# EAGLE design Bitirme deneme (EAGLE 9.6.2)
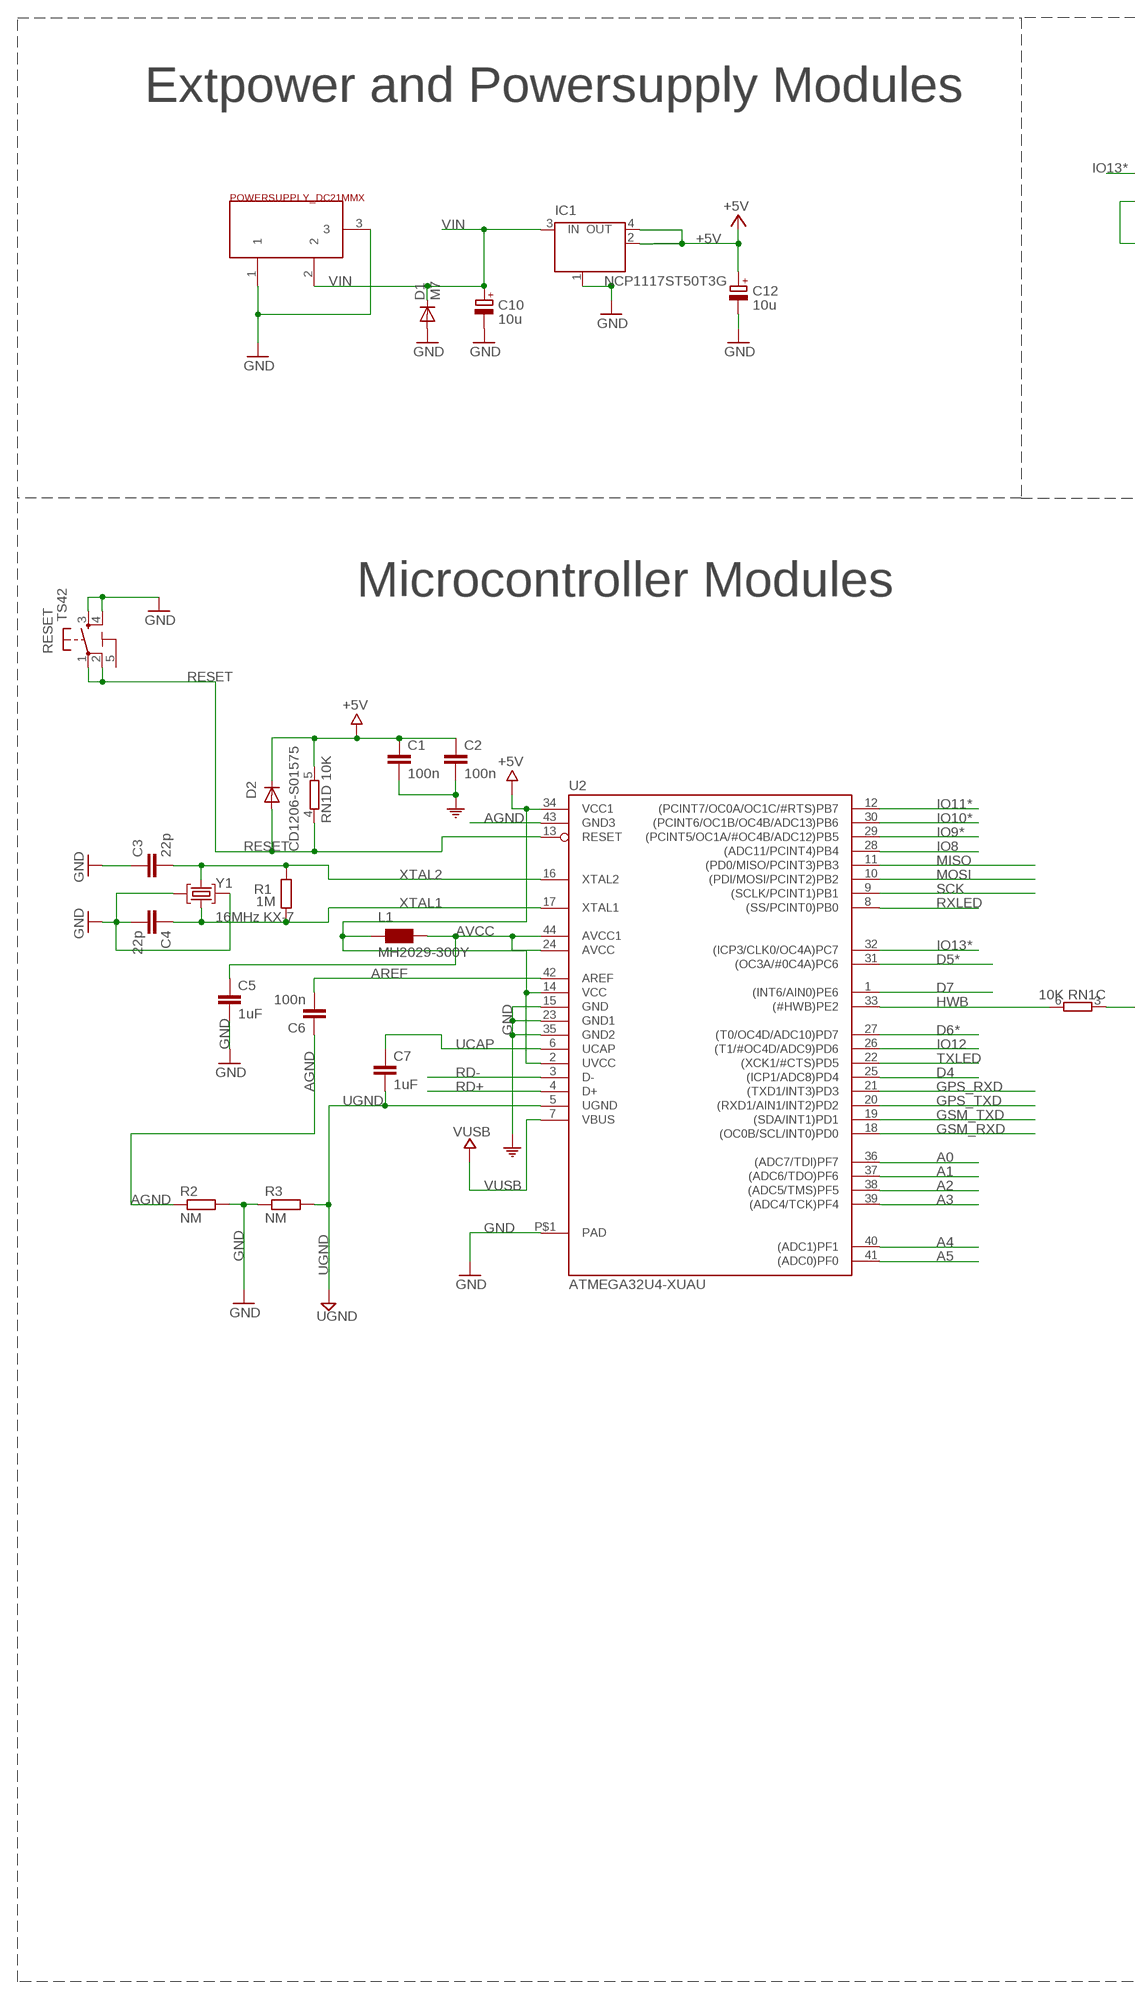
[diagram p0: schematic, sheet 1, part 1 of 2]
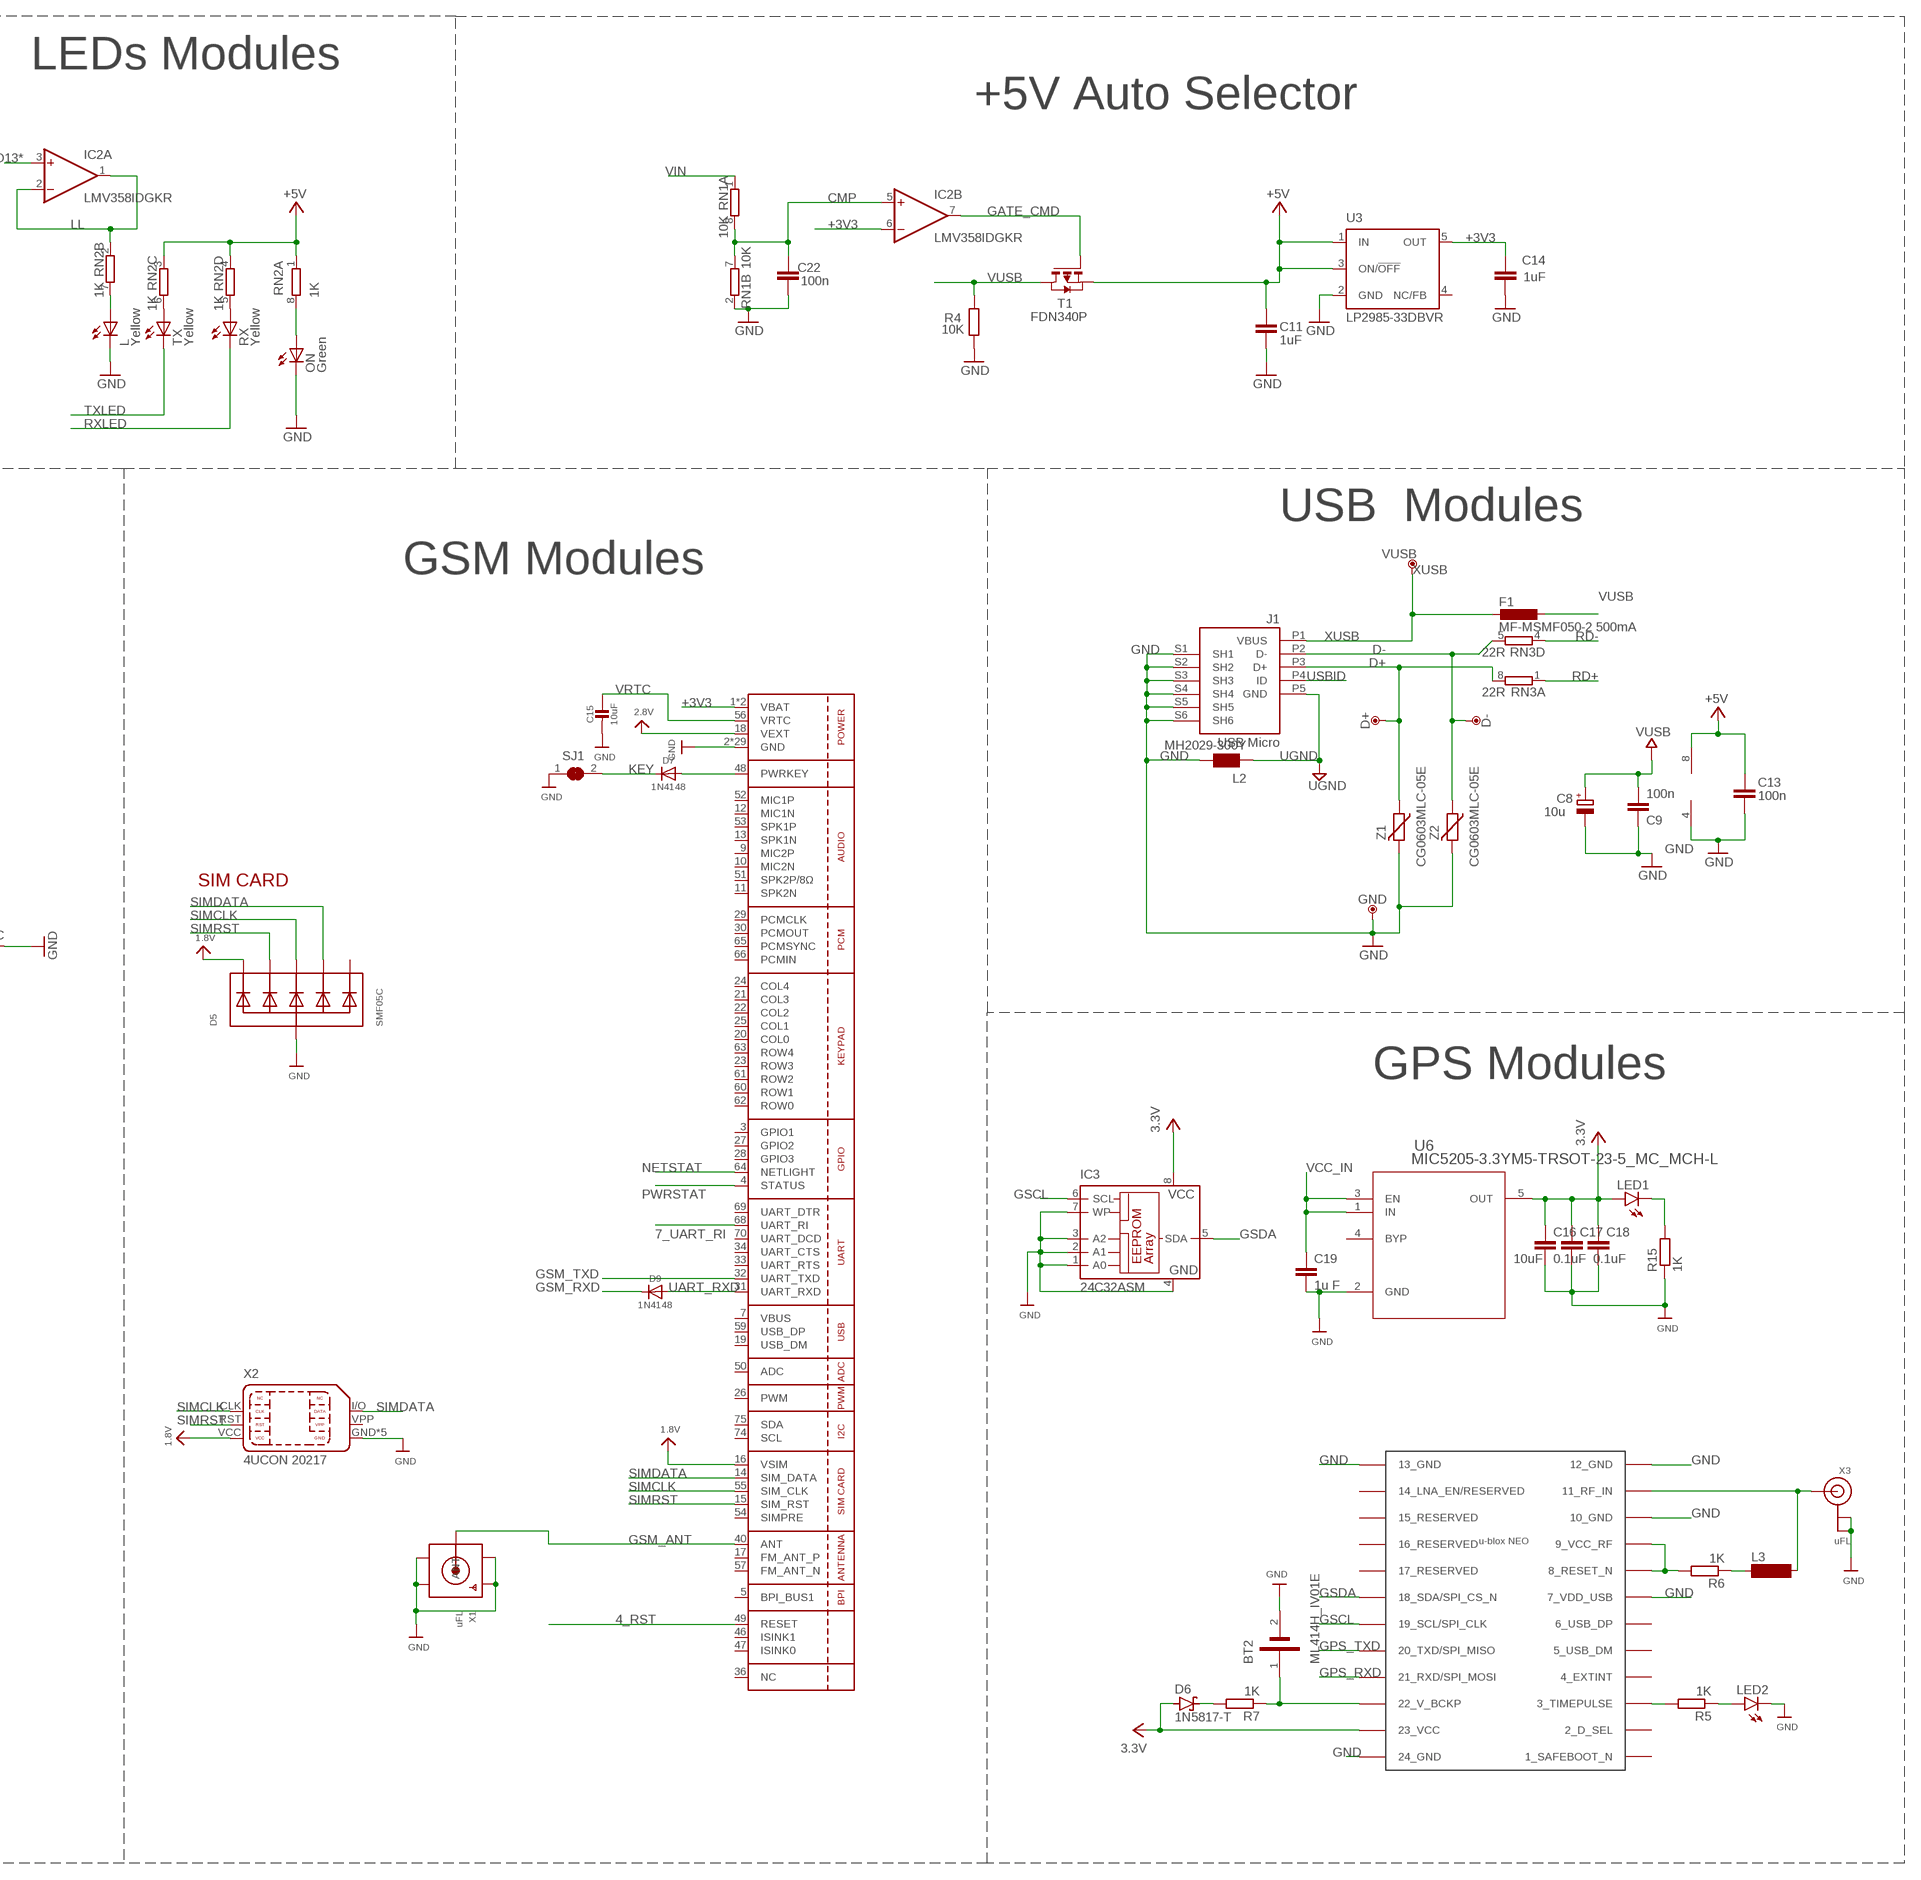
[diagram p1: schematic, sheet 1, part 2 of 2]

## Parts
BT2  ML414H_IV01E  [SEIKO_ML414H_IV01E]
C1  100n  C-EUC0603  [C0603-ROUND]
C2  100n  C-EUC0603  [C0603-ROUND]
C3  22p  C-EUC0603  [C0603-ROUND]
C4  22p  C-EUC0603  [C0603-ROUND]
C5  1uF  C-EUC0603  [C0603-ROUND]
C6  100n  C-EUC0603  [C0603-ROUND]
C7  1uF  C-EUC0603  [C0603-ROUND]
C8  10u  CPOL-EUSMCB  [SMC_B]
C9  100n  C-EUC0603  [C0603-ROUND]
C10  10u  CPOL-EUSMCB  [SMC_B]
C11  1uF  C-EUC0603  [C0603-ROUND]
C12  10u  CPOL-EUSMCB  [SMC_B]
C13  100n  C-EUC0603  [C0603-ROUND]
C14  1uF  C-EUC0603  [C0603-ROUND]
C15  10uF  CAP_CERAMIC_0805MP  [_0805MP]
C16  10uF  C-EUC0603K  [C0603K]
C17  0.1uF  C-EUC0603K  [C0603K]
C18  0.1uF  C-EUC0603K  [C0603K]
C19  1u F  C-EUC0603K  [C0603K]
C22  100n  C-EUC0603  [C0603-ROUND]
D1  M7  DIODE-SMB  [SMB]
D2  CD1206-S01575  DIODE-MINIMELF  [MINIMELF]
D5  SMF05C  TVSARRAY_5LANE  [SOT363]
D6  1N5817-T  [DO41-7.6]
D7  1N4148  DIODESOD-323  [SOD-323]
D9  1N4148  DIODESOD-323  [SOD-323]
D+  DNP  TPTP-1.00MM  [TP-1.00MM]
D-  DNP  TPTP-1.00MM  [TP-1.00MM]
EXTPOWER  POWERSUPPLY_DC21MMX  [POWERSUPPLY_DC-21MM]
F1  MF-MSMF050-2 500mA  L-EUL1812  [L1812]
GND  DNP  TPTP-1.00MM  [TP-1.00MM]
IC1  NCP1117ST50T3G  MC33269ST-3.3T3  [SOT223]
IC2  LMV358IDGKR  LMV358MMX  [MSOP08]
IC3  24C32ASM  [SO-08M]
J1  USB Micro  USB-MICRO-LEGACY  [CON2_USB_MICRO_B_AT]
L  Yellow  LEDCHIPLED_0805  [CHIPLED_0805]
L1  MH2029-300Y  WE-CBF_0805  [0805]
L2  MH2029-300Y  WE-CBF_0805  [0805]
L3  SM-1206  [SM-1206]
LED1  LEDCHIP-LED0603  [CHIP-LED0603]
LED2  LEDCHIPLED_1206  [CHIPLED_1206]
ON  Green  LEDCHIPLED_0805  [CHIPLED_0805]
R1  1M  R-EU_R0603  [R0603-ROUND]
R2  NM  R-EU_R0402  [R0402]
R3  NM  R-EU_R0402  [R0402]
R4  10K  R-EU_R0603  [R0603-ROUND]
R5  1K  R-EU_R0402  [R0402]
R6  1K  R-EU_R0402  [R0402]
R7  1K  R-EU_R0402  [R0402]
R15  1K  R-EU_R0402  [R0402]
RESET  TS42  [TS42]
RN1  10K  4R-NCAY16  [CAY16]
RN2  1K  4R-NCAY16  [CAY16]
RN3  22R  4R-NCAY16  [CAY16]
RX  Yellow  LEDCHIPLED_0805  [CHIPLED_0805]
SJ1  SOLDERJUMPER_CLOSED  [SOLDERJUMPER_CLOSEDWIRE]
T1  FDN340P  PMOSSOT23  [SOT-23]
TX  Yellow  LEDCHIPLED_0805  [CHIPLED_0805]
U2  ATMEGA32U4-XUAU  [TQFP44-PAD]
U3  LP2985-33DBVR  LP2985-XXDBVR33  [SOT23-DBV]
U4  SIM800H/L  GSM_SIM800L  [SIM800L]
U6  MIC5205-3.3YM5-TRSOT-23-5_MC_MCH-L  [SOT-23-5_MC_MCH-L]
U$10  NEO-M8  [NEO-M8]
VUSB  DNP  TPTP-1.00MM  [TP-1.00MM]
X1  uFL  SMACONNECTOR_EDGE_UFL  [SMA_EDGELAUNCH_UFL]
X2  4UCON 20217  SIM_MICRO  [4UCONN_20217]
X3  uFL  ANTENNA_U.FL  [U.FL]
Y1  16MHz KX-7  CRYSTAL-3.2-2.5  [CRYSTAL-3.2-2.5]
Z1  CG0603MLC-05E  VARISTORCN0603  [CT/CN0603]
Z2  CG0603MLC-05E  VARISTORCN0603  [CT/CN0603]

## Nets
1.8V: D5.1(C1) U4.16(VSIM) X2.VCC
2.8V: U4.18(VEXT)
4_RST: U4.49(RESET)
7_UART_RI: U4.68(UART_RI)
+3V3: C14.2 IC2.6(B:-IN) U3.5(OUT) U4.1(VBAT) U4.42(VBAT)
+5V [usbvcc]: C1.1 C2.1 C11.2 C12.+ C13.1 D2.C IC1.2(OUT) IC1.4(OUT) IC2.8(P:V+) L1.1 RN1.5 RN2.1 RN2.3 RN2.4 T1.2(S) U2.2(UVCC) U2.14(VCC) U2.34(VCC1) U3.1(IN) U3.3(ON/!OFF)
A0: U2.36((ADC7/TDI)PF7)
A1: U2.37((ADC6/TDO)PF6)
A2: U2.38((ADC5/TMS)PF5)
A3: U2.39((ADC4/TCK)PF4)
A4: U2.40((ADC1)PF1)
A5: U2.41((ADC0)PF0)
AGND: C6.1 R2.1 U2.43(GND3)
AREF [aref]: C6.2 U2.42(AREF)
AVCC: C5.1 L1.2 U2.24(AVCC) U2.44(AVCC1)
CMP: C22.2 IC2.5(B:+IN) RN1.7 RN1.8
D4: U2.25((ICP1/ADC8)PD4)
D5*: U2.31((OC3A/#0C4A)PC6)
D6*: U2.27((T0/OC4D/ADC10)PD7)
D7: U2.1((INT6/AIN0)PE6)
D+: D+.X J1.P3(D+) RN3.8 Z1.1
D-: D-.X J1.P2(D-) RN3.5 Z2.1
GATE_CMD: IC2.7(B:OUT) T1.3(G)
GND [gnd]: BT2.2(NEG) C1.2 C2.2 C3.1 C4.2 C5.2 C8.- C9.1 C10.- C11.1 C12.- C13.2 C14.1 C15.2 C16.2 C17.2 C18.2 C19.2 C22.1 D1.A D5.2(A) EXTPOWER.1 EXTPOWER.3 GND.X IC1.1(GND/ADJ) IC2.4(P:V-) IC3.1(A0) IC3.2(A1) IC3.3(A2) IC3.4(GND) IC3.7(WP) J1.S1(SH1) J1.S2(SH2) J1.S3(SH3) J1.S4(SH4) J1.S5(SH5) J1.S6(SH6) L2.2 L.C LED2.C ON.C R2.2 R3.1 R4.1 R15.1 RESET.3 RESET.4 RN1.2 RN1.3 SJ1.1 U2.15(GND) U2.23(GND1) U2.35(GND2) U2.P$1(PAD) U3.2(GND) U4.2(GND) U4.6(GND) U4.8(GND) U4.35(GND) U4.37(GND) U4.38(GND) U4.39(GND) U4.41(GND) U4.43(GND) U4.44(GND) U4.45(GND) U4.58(GND) U4.67(GND) U4.71(GND) U4.72(GND) U4.73(GND) U4.76(GND) U4.77(GND) U4.78(GND) U4.79(GND) U4.80(GND) U4.81(GND) U4.82(GND) U4.83(GND) U4.84(GND) U4.85(GND) U4.86(GND) U4.87(GND) U4.88(GND) U6.2(GND) U$10.7(7_VDD_USB) U$10.10(10_GND) U$10.12(12_GND) U$10.13(13_GND) U$10.24(24_GND) X1.GND@1(GND1) X1.GND@2(GND2) X1.GND@3(GND3) X1.GND@4(GND4) X2.GND X2.GND@1(GND) X2.GND@2(GND) X2.GND@3(GND) X2.GND@4(GND) X3.1(GND) X3.2(GND) Y1.2(GND) Y1.4(GND) Z1.2 Z2.2 ; supply symbol labelled COM
GPS_RXD: U2.21((TXD1/INT3)PD3) U$10.21(21_RXD/SPI_MOSI)
GPS_TXD: U2.20((RXD1/AIN1/INT2)PD2) U$10.20(20_TXD/SPI_MISO)
GSCL: IC3.6(SCL) U$10.19(19_SCL/SPI_CLK)
GSDA: IC3.5(SDA) U$10.18(18_SDA/SPI_CS_N)
GSM_ANT: U4.40(ANT) X1.P(ANT)
GSM_RXD: D9.C U2.18((OC0B/SCL/INT0)PD0)
GSM_TXD: U2.19((SDA/INT1)PD1) U4.32(UART_TXD)
HWB: RN1.6 U2.33((#HWB)PE2)
IO8: U2.28((ADC11/PCINT4)PB4)
IO9*: U2.29((PCINT5/OC1A/#OC4B/ADC12)PB5)
IO10*: U2.30((PCINT6/OC1B/OC4B/ADC13)PB6)
IO11*: U2.12((PCINT7/OC0A/OC1C/#RTS)PB7)
IO12: U2.26((T1/#OC4D/ADC9)PD6)
IO13*: IC2.3(A:+IN) U2.32((ICP3/CLK0/OC4A)PC7)
KEY: D7.C SJ1.2
LL: IC2.1(A:OUT) IC2.2(A:-IN) RN2.2
MISO: U2.11((PD0/MISO/PCINT3)PB3)
MOSI: U2.10((PDI/MOSI/PCINT2)PB2)
N$1: R5.2 U$10.3(3_TIMEPULSE)
N$2: LED2.A R5.1
N$3: R6.2 U$10.8(8_RESET_N) U$10.9(9_VCC_RF)
N$4: L3.2 U$10.11(11_RF_IN) X3.3(SIGNAL)
N$5: LED1.C R15.2
N$7: D7.A U4.48(PWRKEY)
N$8: ON.A RN2.8
N$9: D6.C R7.2
N$10: L3.1 R6.1
N$11: L.A RN2.7
N$12: BT2.1(POS) R7.1 U$10.22(22_V_BCKP)
N$14: RN2.6 TX.A
N$15: RN2.5 RX.A
NETSTAT: U4.64(NETLIGHT)
PWRSTAT: U4.4(STATUS)
RD+: RN3.1 U2.4(D+)
RD-: RN3.4 U2.3(D-)
RESET: D2.A RESET.1 RESET.2 RN1.4 U2.13(RESET)
RXLED: RX.C U2.8((SS/PCINT0)PB0)
SCK: U2.9((SCLK/PCINT1)PB1)
SIMCLK: D5.4(C3) U4.55(SIM_CLK) X2.CLK
SIMDATA: D5.5(C4) U4.14(SIM_DATA) X2.I/O(DATA)
SIMRST: D5.3(C2) U4.15(SIM_RST) X2.RST
TXLED: TX.C U2.22((XCK1/#CTS)PD5)
UART_RXD: D9.A U4.31(UART_RXD)
UCAP: C7.1 U2.6(UCAP)
UGND [gnd]: C7.2 J1.P5(GND) L2.1 R3.2 U2.5(UGND)
USBID: J1.P4(ID)
VCC: C16.1 C17.1 C18.1 D6.A IC3.8(VCC) LED1.A U6.5(OUT) U$10.23(23_VCC) ; supply symbol labelled 3.3V
VCC_IN: C19.1 U6.1(IN) U6.3(EN)
VIN [power]: C10.+ D1.C EXTPOWER.2 IC1.3(IN) RN1.1
VRTC: C15.1 U4.56(VRTC)
VUSB: C8.+ C9.2 F1.1 R4.2 T1.1(D) U2.7(VBUS)
XTAL1: C4.1 R1.1 U2.17(XTAL1) Y1.1(C1)
XTAL2: C3.2 R1.2 U2.16(XTAL2) Y1.3(C2)
XUSB [usbvcc]: F1.2 J1.P1(VBUS) VUSB.X
Unconnected: D5.6(C5) RN3.2 RN3.3 RN3.6 RN3.7 U3.4(NC/FB) U4.3(GPIO1) U4.5(BPI_BUS1) U4.9(MIC2P) U4.10(MIC2N) U4.11(SPK2N) U4.12(MIC1N) U4.13(SPK1N) U4.17(FM_ANT_P) U4.19(USB_DM) U4.20(COL0) U4.21(COL3) U4.22(COL2) U4.23(ROW3) U4.24(COL4) U4.25(COL1) U4.26(PWM) U4.27(GPIO2) U4.28(GPIO3) U4.29(PCMCLK) U4.30(PCMOUT) U4.33(UART_RTS) U4.34(UART_CTS) U4.36(NC) U4.46(ISINK1) U4.47(ISINK0) U4.50(ADC) U4.51(SPK2P/8Ω) U4.52(MIC1P) U4.53(SPK1P) U4.54(SIMPRE) U4.57(FM_ANT_N) U4.59(USB_DP) U4.60(ROW1) U4.61(ROW2) U4.62(ROW0) U4.63(ROW4) U4.65(PCMSYNC) U4.66(PCMIN) U4.69(UART_DTR) U4.70(UART_DCD) U4.74(SCL) U4.75(SDA) U6.4(BYP) U$10.1(1_SAFEBOOT_N) U$10.2(2_D_SEL) U$10.4(4_EXTINT) U$10.5(5_USB_DM) U$10.6(6_USB_DP) U$10.14(14_LNA_EN/RESERVED) U$10.15(15_RESERVED) U$10.16(16_RESERVED) U$10.17(17_RESERVED) X2.VPP

## Notes on the sheet
- LEDs Modules
- Extpower and Powersupply Modules | +5V Auto Selector
- USB  Modules
- Microcontroller Modules | GSM Modules
- SIM CARD
- GPS Modules

## Power pins joined to a net without a drawn wire
5-GND: RESET.5(5-GND)
VBUS: U4.7(VBUS)

## Library data of the parts
BT2 = ML414H_IV01E:ML414H_IV01E: Coin 3V 0.001Ah Secondary Check availability <https://pricing.snapeda.com/parts/ML414H%20IV01E/Seiko%20Instruments/view-part?ref=eda>; AVAILABILITY: In Stock; DESCRIPTION: Coin, 4.8mm 3 V Lithium Battery Rechargeable (Secondary) 1mAh; MF: Seiko Instruments; MP: ML414H IV01E; PACKAGE: SOT-89 Seiko; PRICE: None; PURCHASE-URL: https://pricing.snapeda.com/search/part/ML414H IV01E/?ref=eda
C1-C7 C9 C11 C13 C14 C22 = SmartPrj:C-EU: CAPACITOR, European symbol
C8 C10 C12 = rcl:CPOL-EU: POLARIZED CAPACITOR, European symbol
C15 = microbuilder:CAP_CERAMIC: Ceramic Capacitors For new designs, use the packages preceded by an '_' character since they are more reliable: The following footprints should be used on most boards: _0402 - Standard footprint for regular board layouts _0603 - Standard footprint for regular board layouts _0805 - Standard footprint for regular board layouts _1206 - Standard footprint for regular board layouts For extremely tight-pitch boards where space is at a premium, the following 'micro-pitch' footprints can be used (smaller pads, no silkscreen outline, etc.): _0402MP - Micro-pitch footprint for very dense/compact boards _0603MP - Micro-pitch footprint for very dense/compact boards _0805MP - Micro-pitch footprint for very dense/compact boards _1206MP - Micro-pitch footprint for very dense/compact boards
C16-C19 = rcl:C-EU: CAPACITOR, European symbol; SPICEPREFIX: C
D1 D2 = diode:DIODE-: DIODE
D5 = microbuilder:TVSARRAY_5LANE: Voltage Transient Suppressor Array SOT363 SMF05C - 100W 5V: Digikey - SMF05CT1GOSCT-ND
D6 = diode:1N581*: 1.0A SCHOTTKY BARRIER RECTIFIER Source: http://www.diodes.com/datasheets/ds23001.pdf
D7 D9 = microbuilder:DIODE: Diode SMA Model Volts Amps Type Vf Ir Digikey # Notes SSA34-E3 40V 3A Schottky 480mV @ 3A 200uA @ 40V SSA34-E3/61TGITR-ND CDBA120-G 20V 1A Schottky 500mV @ 1A 500uA @ 20V 641-1014-6-ND REEL MBRA210 10V 2A Schottky 350mV @ 2A 700uA @ 10V MBRA210LT3 SOD-123 Model Volts Amps Type Vf Ir Order # Notes BAT54T1G 30V 200mA Schottky 800mV @ 200mA 2uA @ 25V BAT54T1GOSTR-ND B0530W 30V 500mA Schottky 430mV @ 500mA 130uA @ 30V B0530W-FDICT-ND REEL MBR120 20V 1A Schottky 340mV @ 1A MBR120VLSFT1GOSCT-ND SOD-323 Model Volts Amps Type Vf Ir Order # Notes PMEG2005EJ 20V 500mA Schottky 355mV @ 500mA 568-4110-1-ND ZLLS410 10V 570mA Schottky 380mV @ 570mA ZLLS410CT-ND 1N4148WS 75V 150mA Silicon/Simple 1V 1N4148WSFSCT-ND REEL SOD-523 Model Volts Amps Type Vf Ir Order # Notes BAT54XV2 30V 200mA Schottky 0.8V @ 100mA BAT54XV2CT-ND TB751S 30V 30mA Schottky RB751S-40TE61CT-ND SOT23-R/W (R = Solder Paste/Reflow Ovens, W = Hand-Soldering) Model Volts Amps Type Vf Ir Order # Notes BAT54FILM 40V 300mA Schottky 497-7162-1-ND POWERDI-5 Model Volts Amps Type Vf Ir Order # Notes PDS560 60V 5A Schottky 670mV @ 5A 150uA @ 60V PDS560DICT-ND
D+ D- GND VUSB = Arduino-utility:TP: Testpoint; DATASHEET: DNP; DISTRIBUTOR-LINK: DNP; DISTRIBUTOR-PN: DNP; MANUFACTURER: DNP; MANUFACTURER-PN: DNP
EXTPOWER = SmartPrj:POWERSUPPLY_DC21MM
F1 = rcl:L-EU: INDUCTOR, European symbol
IC1 = linear:MC33269ST*: Adjustable Output Low Dropout Voltage Regulator 800 mA Source: http://www.onsemi.com/pub/Collateral/MC33269-D.PDF
IC2 = linear:LMV358?*: Dual General Purpose, Low Voltage, Rail-to-Rail Output Operational Amplifiers Source: http://www.national.com/mpf/LM/LMV321.html http://www.national.com/dt/lmv_qual.pdf
IC3 = microchip:24*: Serial EEPROM I2C; MPN: IS24C32A-2GLI; OC_FARNELL: 1718129; OC_NEWARK: 43M4588
J1 = Arduino-connectors:USB-MICRO-LEGACY; DATASHEET: http://media.digikey.com/pdf/Data%20Sheets/FCI%20PDFs/10118193-0001LF_Webpage.PDF; DISTRIBUTOR-LINK: http://www.digikey.it/product-detail/en/10118193-0001LF/609-4616-2-ND/2785388; DISTRIBUTOR-PN: 609-4616-2-ND; MANUFACTURER: FCI; MANUFACTURER-PN: 10118193-0001LF
L LED1 LED2 ON RX TX = led:LED: LED OSRAM: - CHIPLED LG R971, LG N971, LY N971, LG Q971, LY Q971, LO R971, LY R971 LH N974, LH R974 LS Q976, LO Q976, LY Q976 LO Q996 - Hyper CHIPLED LW Q18S LB Q993, LB Q99A, LB R99A - SideLED LS A670, LO A670, LY A670, LG A670, LP A670 LB A673, LV A673, LT A673, LW A673 LH A674 LY A675 LS A676, LA A676, LO A676, LY A676, LW A676 LS A679, LY A679, LG A679 - Hyper Micro SIDELED® LS Y876, LA Y876, LO Y876, LY Y876 LT Y87S - SmartLED LW L88C, LW L88S LB L89C, LB L89S, LG L890 LS L89K, LO L89K, LY L89K LS L896, LA L896, LO L896, LY L896 - TOPLED LS T670, LO T670, LY T670, LG T670, LP T670 LSG T670, LSP T670, LSY T670, LOP T670, LYG T670 LG T671, LOG T671, LSG T671 LB T673, LV T673, LT T673, LW T673 LH T674 LS T676, LA T676, LO T676, LY T676, LB T676, LH T676, LSB T676, LW T676 LB T67C, LV T67C, LT T67C, LS T67K, LO T67K, LY T67K, LW E67C LS E67B, LA E67B, LO E67B, LY E67B, LB E67C, LV E67C, LT E67C LW T67C LS T679, LY T679, LG T679 LS T770, LO T770, LY T770, LG T770, LP T770 LB T773, LV T773, LT T773, LW T773 LH T774 LS E675, LA E675, LY E675, LS T675 LS T776, LA T776, LO T776, LY T776, LB T776 LHGB T686 LT T68C, LB T68C - Hyper Mini TOPLED® LB M676 - Mini TOPLED Santana® LG M470 LS M47K, LO M47K, LY M47K Source: http://www.osram.convergy.de LUXEON: - LUMILED® LXK2-PW12-R00, LXK2-PW12-S00, LXK2-PW14-U00, LXK2-PW14-V00 LXK2-PM12-R00, LXK2-PM12-S00, LXK2-PM14-U00 LXK2-PE12-Q00, LXK2-PE12-R00, LXK2-PE12-S00, LXK2-PE14-T00, LXK2-PE14-U00 LXK2-PB12-K00, LXK2-PB12-L00, LXK2-PB12-M00, LXK2-PB14-N00, LXK2-PB14-P00, LXK2-PB14-Q00 LXK2-PR12-L00, LXK2-PR12-M00, LXK2-PR14-Q00, LXK2-PR14-R00 LXK2-PD12-Q00, LXK2-PD12-R00, LXK2-PD12-S00 LXK2-PH12-R00, LXK2-PH12-S00 LXK2-PL12-P00, LXK2-PL12-Q00, LXK2-PL12-R00 Source: www.luxeon.com KINGBRIGHT: KA-3528ASYC Source: www.kingbright.com
L1 L2 = wuerth-elektronik:WE-CBF: SMD EMI Suppression Ferrite Beads - excellent anti-EMI properties - low DCR - impedances till 3000 ohms - rated current up to 6 A
L3 = inductor-neosid:SM-1206: INDUCTOR SMD chip inductor; OC_FARNELL: unknown; OC_NEWARK: unknown
R1-R7 R15 = SmartPrj:R-EU_: RESISTOR, European symbol
RESET = SmartPrj:TS42: TS42 Dongnan Electronics Tact switch VDC 12V - 50mA
RN1-RN3 = resistor-dil:4R-N: Array Chip Resistor Source: RS Component / Phycomp
SJ1 = microbuilder:SOLDERJUMPER_CLOSED: Solder Jumper - Closed These solder jumpers are closed by default CLOSEDWIRE - 10 mil trace between pads that can be cut and resoldered later CLOSEDPERM - 63 mil trace between pads for a permanent connection (used to 'bridge' two signals, a shameless hack for Eagle). Can double as a test point as well (no cream layer)
T1 = zetex:PMOSSOT23: MOS FET
U2 = SmartPrj:ATMEGA32U4-XU
U3 = SmartPrj:LP2985-XXDBVR: ULTRALOW-POWER 50-mA LOW-DROPOUT LINEAR REGULATORS 50-mA Low-Dropout Regulator Source: http://focus.ti.com/lit/ds/symlink/tps77001.pdf
U4 = microbuilder:GSM_SIM800L: SIM800K Quad-Band GSM/GPRS Module 850/900/1800/1900 MHz Bluetooth EDR (3.0) FM Band: 76-109MHz (50kHz steps) -40 - 85°C
U6 = 2022-04-20_01-07-48_Library:MIC5205-3.3YM5-TR; COPYRIGHT: Copyright (C) 2022 Ultra Librarian. All rights reserved.; MANUFACTURER_PART_NUMBER: MIC5205-3.3YM5-TR; MFR_NAME: Microchip
U$10 = ubloxLib:NEO-M8: u-blox NEO GNSS module
X1 = microbuilder:SMACONNECTOR: SMA Connector 90° DIP SMA Connector, 50 Ohm (4UConnector: 07259)
X2 = microbuilder:SIM_MICRO: Micro SIM Card Holder 78723-1001 = Molex Push/Pull connector (8-Pin)
X3 = microbuilder:ANTENNA_U.FL: U.FL Antenna Connector
Y1 = SmartPrj:CRYSTAL-3.2-2.5
Z1 Z2 = varistor:VARISTOR: VARISTOR

## Net classes
0 default: width 0.254 mm, drill 0.499 mm, clearance 0.254 mm
1 power: width 0.254 mm, drill 0.499 mm, clearance 0.254 mm
2 gnd: width 0.254 mm, drill 0.499 mm, clearance 0.254 mm
3 usbvcc: width 0.254 mm, drill 0.499 mm, clearance 0.254 mm
4 aref: width 0.254 mm, drill 0.499 mm, clearance 0.254 mm

## Board
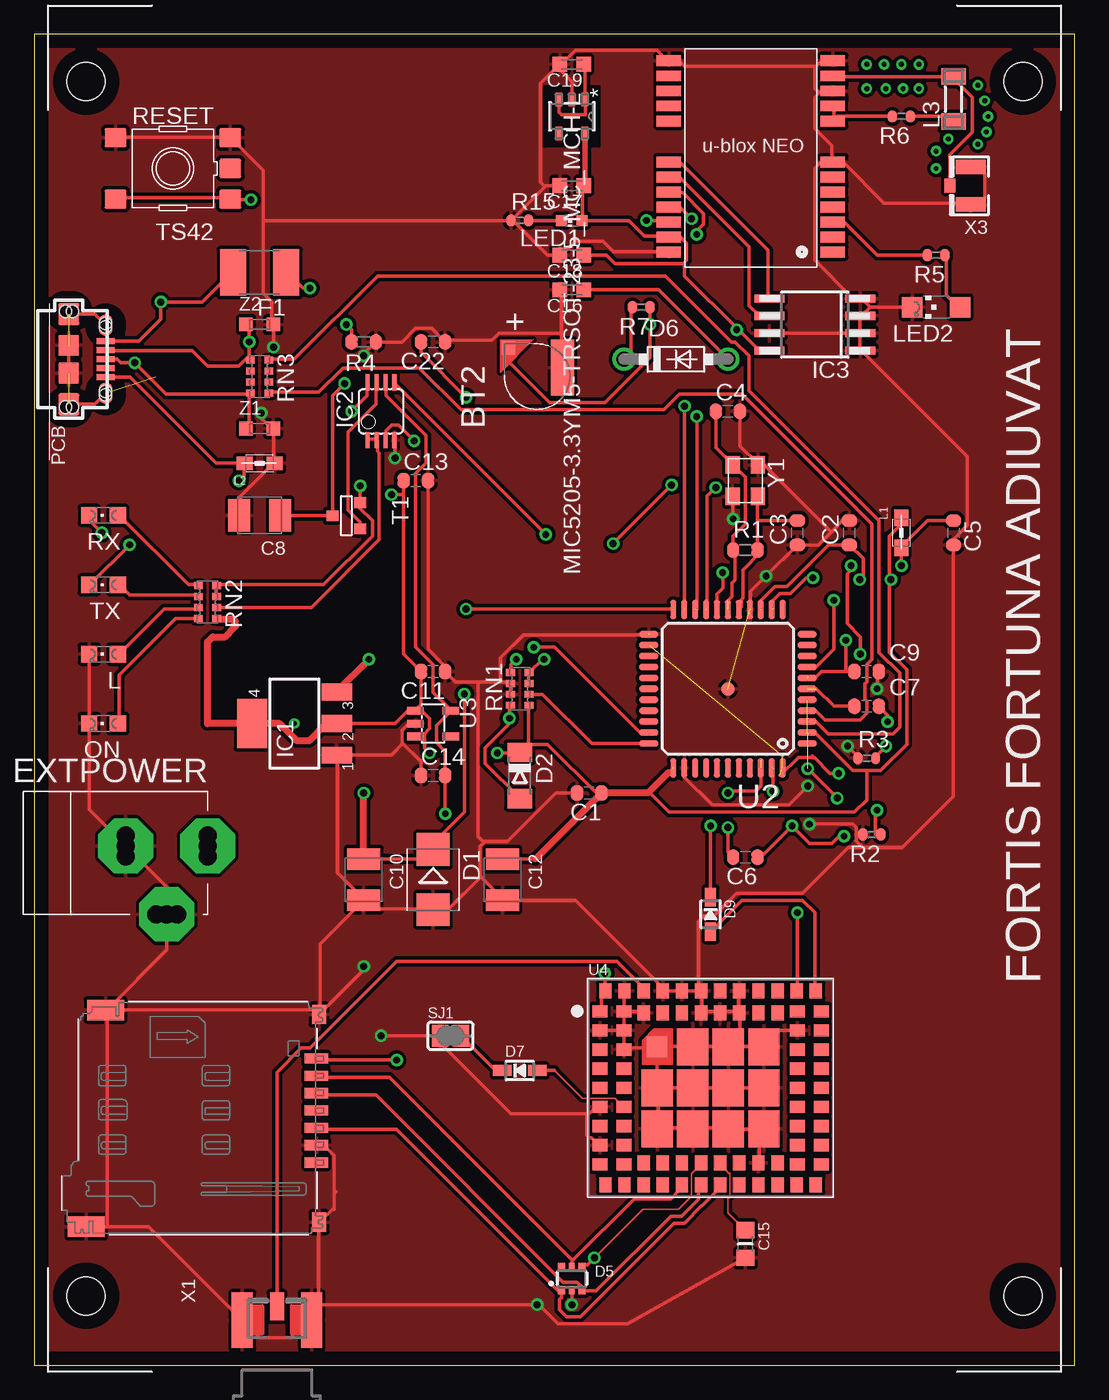
[diagram p2: board, top side]
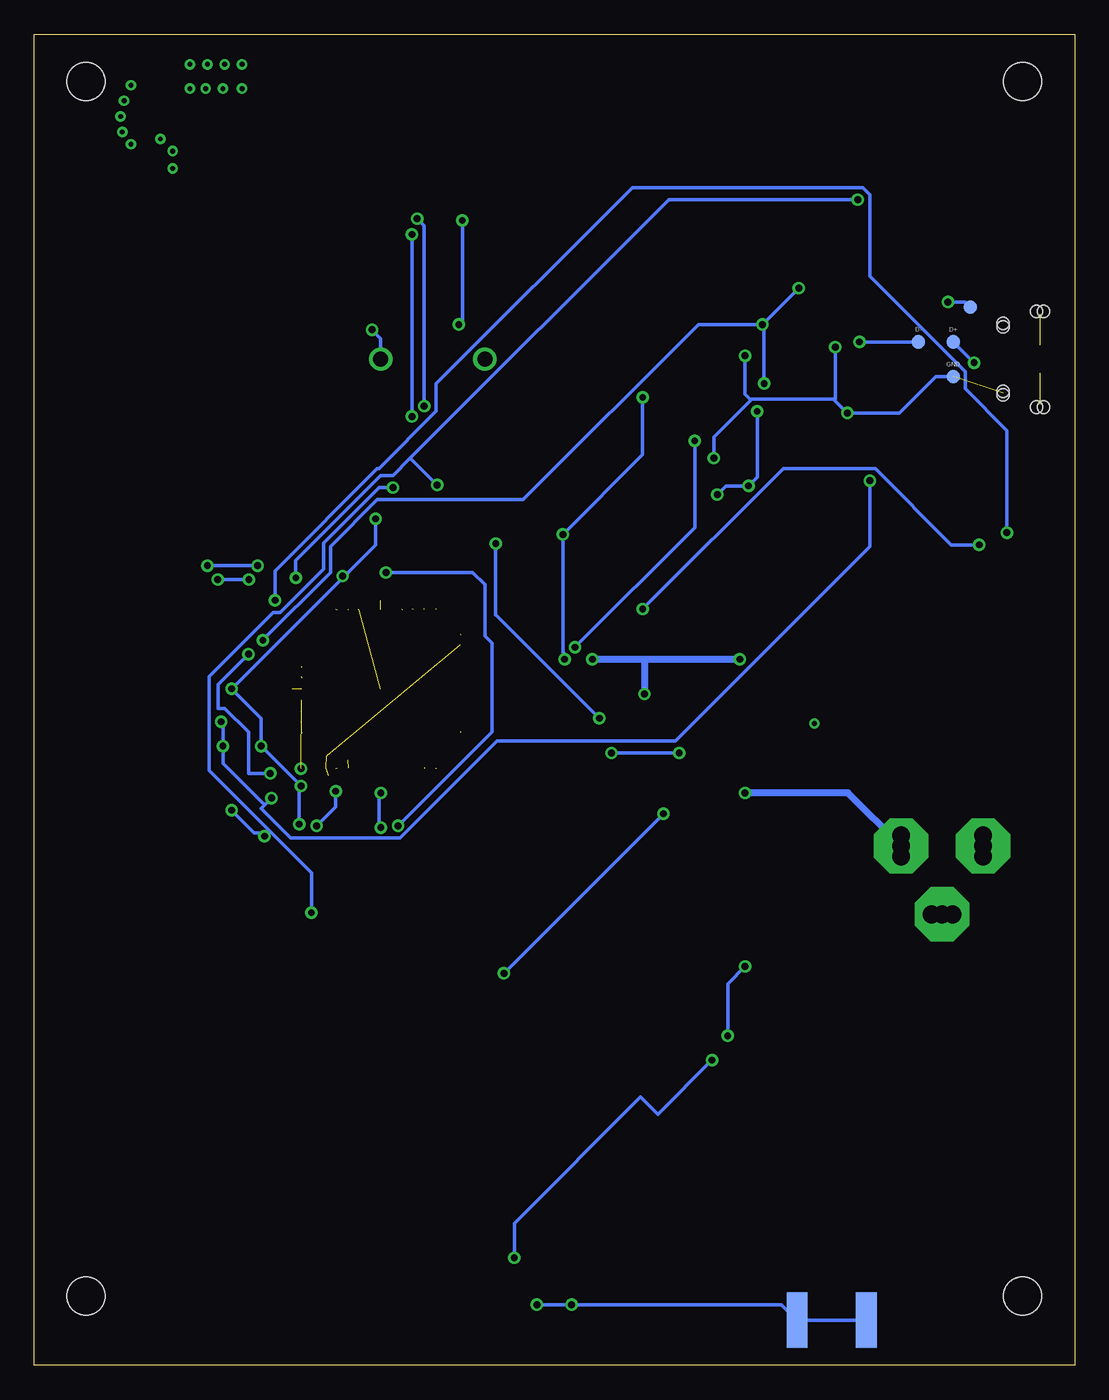
[diagram p3: board, bottom side, seen from below]

Size 76.18 x 97.46 mm. Coordinates in mm from the lower left corner, seen from the top.
Outline: 0,0 76.18,0 76.18,97.46 0,97.46 0,0
Copper layers (1*16): Top 0.035mm / dielectric 1.5mm / Bottom 0.035mm
Design rules "default": minimum track width 6mil, minimum drill 0.35mm, track to track 6mil, track to pad 6mil, pad to pad 6mil, via to via 6mil, smd to smd 6mil, copper to edge 40mil, drill to drill 6mil, minimum pad ring 10mil, minimum via ring 8mil, stop-mask expansion 4mil, vias tented up to drill 0mil, thermal gap 10mil

### Footprints (pad centres in the part's own frame; a part is rotated, then mirrored left to right if it is on the bottom)
SEIKO_ML414H_IV01E = smd 1 x 1: 1 2.1,2.1 | smd 4.1 x 1.7: 2 0.65,-1.85
C0603-ROUND = smd 0.898 x 1.1: 1 -0.889,0; 2 0.889,0
SMC_B = smd 1.6 x 2.4: + -1.5,0; - 1.5,0
_0805MP = smd 1.2 x 1.3: 1 -1.016,0; 2 1.016,0
C0603K = smd 1.05 x 1.08: 1 -0.875,0; 2 0.875,0
SMB = smd 2.4 x 2.4: A 2.2,0; C -2.2,0
MINIMELF = smd 1.4 x 1.8: A 1.7,0; C -1.7,0
SOT363 = smd 0.5 x 0.5: 1 -0.75,-0.9; 3 0.75,-0.9; 4 0.75,0.9; 6 -0.75,0.9 | smd 0.4 x 0.5: 2 0,-0.9; 5 0,0.9
DO41-7.6 = drill 1.1 pad 1.7: A 3.81,0; C -3.81,0
SOD-323 = smd 1.35 x 0.8: A 1.27,0; C -1.27,0
TP-1.00MM = smd 1 x 1 bottom: X 0,0
POWERSUPPLY_DC-21MM = drill 1.3 pad 4 octagon: 1 -5.08,-3.353; 2 -0.076,-6.35; 3 -0.076,-0.356 | drill 1.3: 4 -5.08,-4.115; 5 -5.08,-2.591; 6 -0.838,-0.356; 7 0.686,-0.356; 8 -0.838,-6.35; 9 0.686,-6.35
L1812 = smd 1.9 x 3.4: 1 -1.95,0; 2 1.95,0
SOT223 = smd 1.219 x 2.235: 1 -2.311,-3.099; 2 0,-3.099; 3 2.311,-3.099 | smd 3.6 x 2.2: 4 0,3.099
MSOP08 = smd 0.3 x 1.2: 1 -0.976,-2.113; 2 -0.326,-2.113; 3 0.324,-2.113; 4 0.974,-2.113; 5 0.974,2.112; 6 0.324,2.112; 7 -0.326,2.112; 8 -0.976,2.112
SO-08M = smd 0.6 x 2.2: 1 -1.905,-3.33; 2 -0.635,-3.33; 3 0.635,-3.33; 4 1.905,-3.33; 5 1.905,3.33; 6 0.635,3.33; 7 -0.635,3.33; 8 -1.905,3.33
CON2_USB_MICRO_B_AT = smd 0.406 x 1.346: P1 -1.321,2.692; P2 -0.66,2.692; P3 0,2.692; P4 0.66,2.692; P5 1.321,2.692 | smd 1.651 x 1.549: S1 -3.302,0; S2 3.302,0 | smd 1.524 x 1.016: S3 -2.489,2.692; S4 2.489,2.692 | smd 1.524 x 1.524: S5 -1.016,0; S6 1.016,0 | hole 0.9: -3.505,0.254; -3.505,-0.254; 3.505,0.254; 3.505,-0.254; -2.616,2.692; -2.362,2.692; 2.362,2.692; 2.616,2.692
CHIPLED_0805 = smd 1.2 x 1.2: A 0,-1.05; C 0,1.05
0805 = smd 1.2 x 1: 1 -1.1,0; 2 1.1,0
SM-1206 = smd 1.2 x 1.8: 1 -1.65,0; 2 1.65,0
CHIP-LED0603 = smd 0.8 x 0.8: A 0,-0.75; C 0,0.75
CHIPLED_1206 = smd 1.5 x 1.5: A 0,-1.75; C 0,1.75
R0603-ROUND = smd 0.898 x 1.1: 1 -0.889,0; 2 0.889,0
R0402 = smd 0.7 x 0.9: 1 -0.65,0; 2 0.65,0
TS42 = smd 1.6 x 1.4: 1 -4.2,2.25; 2 4.2,2.25; 3 -4.2,-2.25; 4 4.2,-2.25; 5 -4.2,0
CAY16 = smd 0.5 x 0.65: 1 -1.2,-0.675; 2 -0.4,-0.675; 3 0.4,-0.675; 4 1.2,-0.675; 5 1.2,0.675; 6 0.4,0.675; 7 -0.4,0.675; 8 -1.2,0.675
SOLDERJUMPER_CLOSEDWIRE = smd 1.168 x 1.6: 1 -0.762,0; 2 0.762,0 | smd 0.635 x 0.203: WIRE 0,0
SOT-23 = smd 0.787 x 0.889: 1 0.025,-1.016; 2 -0.94,1.016; 3 0.991,1.016
TQFP44-PAD = smd 1.4 x 0.45: 1 -5.8,4; 2 -5.8,3.2; 3 -5.8,2.4; 4 -5.8,1.6; 5 -5.8,0.8; 6 -5.8,0; 7 -5.8,-0.8; 8 -5.8,-1.6; 9 -5.8,-2.4; 10 -5.8,-3.2; 11 -5.8,-4; 23 5.8,-4; 24 5.8,-3.2; 25 5.8,-2.4; 26 5.8,-1.6; 27 5.8,-0.8; 28 5.8,0; 29 5.8,0.8; 30 5.8,1.6; 31 5.8,2.4; 32 5.8,3.2; 33 5.8,4 | smd 0.45 x 1.4: 12 -4,-5.8; 13 -3.2,-5.8; 14 -2.4,-5.8; 15 -1.6,-5.8; 16 -0.8,-5.8; 17 0,-5.8; 18 0.8,-5.8; 19 1.6,-5.8; 20 2.4,-5.8; 21 3.2,-5.8; 22 4,-5.8; 34 4,5.8; 35 3.2,5.8; 36 2.4,5.8; 37 1.6,5.8; 38 0.8,5.8; 39 0,5.8; 40 -0.8,5.8; 41 -1.6,5.8; 42 -2.4,5.8; 43 -3.2,5.8; 44 -4,5.8 | smd 1 x 1: P$1 0,0
SOT23-DBV = smd 0.55 x 1.2: 1 -0.95,-1.3; 2 0,-1.3; 3 0.95,-1.3; 4 0.95,1.3; 5 -0.95,1.3
SIM800L = smd 1.1 x 0.9: 1 -8.1,5.6; 2 -8.1,4.2; 3 -8.1,2.8; 4 -8.1,1.4; 5 -8.1,0; 6 -8.1,-1.4; 7 -8.1,-2.8; 8 -8.1,-4.2; 9 -8.1,-5.6; 22 8.1,-5.6; 23 8.1,-4.2; 24 8.1,-2.8; 25 8.1,-1.4; 26 8.1,0; 27 8.1,1.4; 28 8.1,2.8; 29 8.1,4.2; 30 8.1,5.6; 43 -6.36,5.6; 44 -6.36,4.2; 45 -6.36,2.8; 46 -6.36,1.4; 47 -6.36,0; 48 -6.36,-1.4; 49 -6.36,-2.8; 50 -6.36,-4.2; 51 -6.36,-5.6; 60 6.36,-5.6; 61 6.36,-4.2; 62 6.36,-2.8; 63 6.36,-1.4; 64 6.36,0; 65 6.36,1.4; 66 6.36,2.8; 67 6.36,4.2; 68 6.36,5.6 | smd 0.9 x 1.1: 10 -7.7,-7.1; 11 -6.3,-7.1; 12 -4.9,-7.1; 13 -3.5,-7.1; 14 -2.1,-7.1; 15 -0.7,-7.1; 16 0.7,-7.1; 17 2.1,-7.1; 18 3.5,-7.1; 19 4.9,-7.1; 20 6.3,-7.1; 21 7.7,-7.1; 31 7.7,7.1; 32 6.3,7.1; 33 4.9,7.1; 34 3.5,7.1; 35 2.1,7.1; 36 0.7,7.1; 37 -0.7,7.1; 38 -2.1,7.1; 39 -3.5,7.1; 40 -4.9,7.1; 41 -6.3,7.1; 42 -7.7,7.1; 52 -4.9,-5.5; 53 -3.5,-5.5; 54 -2.1,-5.5; 55 -0.7,-5.5; 56 0.7,-5.5; 57 2.1,-5.5; 58 3.5,-5.5; 59 4.9,-5.5; 69 4.9,5.5; 70 3.5,5.5; 71 2.1,5.5; 72 0.7,5.5; 73 -0.7,5.5; 74 -2.1,5.5; 75 -3.5,5.5; 76 -4.9,5.5 | smd 1.5 x 1.5: 77 -3.9,3 | smd 2.3 x 2.7: 78 -3.9,0; 79 -3.9,-3; 80 -1.3,-3; 81 1.3,-3; 82 3.9,-3; 83 3.9,0; 84 3.9,3; 85 1.3,3; 86 -1.3,3; 87 -1.3,0; 88 1.3,0
SOT-23-5_MC_MCH-L = smd 1.01 x 0.458: 1 -1.245,0.95; 2 -1.245,0; 3 -1.245,-0.95; 4 1.245,-0.95; 5 1.245,0.95
BL2,8K = hole 2.794: 3.81,-44.45; 3.81,44.45
NEO-M8 = smd 1.8 x 0.8: 1 6.4,-7.4; 2 6.4,-6.3; 3 6.4,-5.2; 4 6.4,-4.1; 5 6.4,-3; 6 6.4,-1.9; 7 6.4,-0.8; 8 6.4,2.2; 9 6.4,3.3; 10 6.4,4.4; 11 6.4,5.5; 12 6.4,6.6; 13 -5.6,6.6; 14 -5.6,5.5; 15 -5.6,4.4; 16 -5.6,3.3; 17 -5.6,2.2; 18 -5.6,-0.8; 19 -5.6,-1.9; 20 -5.6,-3; 21 -5.6,-4.1; 22 -5.6,-5.2; 23 -5.6,-6.3; 24 -5.6,-7.4
SMA_EDGELAUNCH_UFL = smd 4.064 x 1.524: GND@1 2.032,-2.54; GND@2 2.032,2.54 | smd 4.064 x 1.524 bottom: GND@3 2.032,2.54; GND@4 2.032,-2.54 | smd 2.032 x 1.016: P 3.048,0
4UCONN_20217 = smd 0.75 x 1.7: CLK -12.31,16.86; GND -5.96,16.86; I/O -11.04,16.86; RST -9.77,16.86; SW -4.69,16.86; VCC -7.23,16.86; VPP -8.5,16.86 | smd 1.4 x 1.05: GND@1 -15.53,17.06; GND@4 -0.33,17.06 | smd 1.5 x 2.7: GND@2 -15.86,1.42; GND@3 0,0
U.FL = smd 2.2 x 1.05: 1 0,1.375; 2 0,-1.375 | smd 0.8 x 1: 3 1.525,0
CRYSTAL-3.2-2.5 = smd 1.3 x 1.05: 1 -1.15,-0.925; 2 1.15,-0.925; 3 1.15,0.925; 4 -1.15,0.925
CT/CN0603 = smd 1 x 1: 1 -1,0; 2 1,0

### Placement (x,y rotation side)
BT2  36.83,72.39 90 top
C1  40.64,41.91 180 top
C2  59.69,60.96 90 top
C3  55.88,60.96 90 top
C4  50.8,69.85 0 top
C5  67.31,60.96 270 top
C6  52.07,37.21 180 top
C7  60.96,48.26 0 top
C8  16.51,62.23 180 top
C9  60.96,50.8 180 top
C10  24.13,35.56 270 top
C11  29.21,50.8 180 top
C12  34.29,35.56 270 top
C13  27.94,64.77 0 top
C14  29.21,43.18 0 top
C15  52.07,8.89 270 top
C16  39.37,78.74 180 top
C17  39.37,86.36 180 top
C18  39.37,81.28 180 top
C19  39.37,95.25 180 top
C22  29.21,74.93 180 top
D1  29.21,35.56 270 top
D2  35.56,43.18 270 top
D5  39.37,6.35 0 top
D6  46.99,73.66 0 top
D7  35.56,21.59 0 top
D9  49.53,33.02 270 top
D+  8.89,74.93 0 top
D-  11.43,74.93 0 top
EXTPOWER  6.35,38.1 90 top
F1  16.51,80.01 180 top
GND  8.89,72.39 0 top
IC1  19.05,46.99 90 top
IC2  25.4,69.85 0 top
IC3  57.15,76.2 90 top
J1  2.54,73.66 270 top
L  5.08,52.07 90 top
L1  63.5,60.96 270 top
L2  16.51,66.04 0 top
L3  67.31,92.71 90 top
LED1  39.37,83.82 90 top
LED2  66.04,77.47 90 top
ON  5.08,46.99 90 top
R1  52.07,59.69 0 top
R2  61.34,38.86 180 top
R3  60.96,44.45 0 top
R4  24.13,74.93 180 top
R5  66.04,81.28 180 top
R6  63.5,91.44 180 top
R7  44.45,77.47 180 top
R15  35.56,83.82 0 top
RESET  10.16,87.63 180 top
RN1  35.56,49.53 270 top
RN2  12.7,55.88 90 top
RN3  16.51,72.39 90 top
RX  5.08,62.23 90 top
SJ1  30.48,24.13 0 top
T1  22.86,62.23 270 top
TX  5.08,57.15 90 top
U2  50.8,49.53 180 top
U3  29.21,46.99 270 top
U4  49.53,20.32 0 top
U6  39.37,91.44 270 top
U$1  [BL2,8K]  0,49.53 0 top
U$10  52.07,88.9 0 top
U$18  [BL2,8K]  76.2,49.53 180 top
VUSB  7.62,77.47 0 top
X1  17.78,1.27 90 top
X2  3.81,10.16 270 top
X3  68.58,86.36 180 top
Y1  52.07,64.77 270 top
Z1  16.51,68.58 0 top
Z2  16.51,76.2 0 top

### Tracks (layer width: path | path; a pad name or v marks a point on that pad's centre or on a via)
1.8V
  Top 0.254: U4.16 50.17,13.21 50.17,12.95 48.9,11.68 48.87,11.68 47.6,10.41 46.86,10.41 40.01,3.56 38.99,3.56 38.48,4.06 38.48,4.83 38.61,4.95 38.61,5.33 D5.1 38.48,5.33 26.54,17.27 20.7,17.27 X2.VCC
+3V3  (via drill 0.5)
  Top 0.254: U4.1 41.53,26.04 41.53,27.05 41.78,27.3 U4.42 41.78,27.43 v41.78,28.7 | IC2.6 25.78,71.88 25.78,70.99 28.7,68.07 28.7,66.04 27.94,65.28 27.94,52.58 29.21,51.31 29.21,49.28 30.48,48.01 U3.5 30.48,47.88 29.46,46.86 29.46,45.59 30.1,44.96 C14.2 v30.1,40.39
  Bottom 0.254: v30.1,40.39 v41.78,28.7
+5V  (via drill 0.5)  (3 unrouted)
  Top 0.254: RN2.3 13.33,56.39 13.33,57.02 RN2.4 13.46,57.15 21.21,57.15 24.77,60.71 24.77,61.85 23.88,62.74 T1.2 v23.88,64.39 | v23.24,69.85 24.38,70.99 24.38,71.88 IC2.8 | 13.46,54.61 RN2.1 13.3,54.61 | IC1.4 15.88,46.99 15.88,47.75 IC1.4 | U3.1 27.94,48.01 28.32,48.39 C11.2 27.05,52.07 27.05,63.75 | 27.05,63.75 C13.1 | 28.51,46.16 28.96,46.61 28.96,47.37 28.19,48.13 U3.1 | 28.51,46.16 28.45,46.1 27.94,46.1 U3.3 | IC1.2 26.42,46.99 27.3,47.88 27.81,47.88 U3.1 | 22.1,46.99 IC1.2 | 27.05,63.75 v26.16,63.75 | RN1.5 36.2,48.26 36.2,45.59 35.56,44.96 D2.C | 46.74,43.69 46.42,43.37 | 36.7,37.08 34.29,37.08 C12.+ | D2.C 36.2,45.47 37.59,45.47 41.28,41.78 C1.1 | 53.21,55.37 53.21,56.01 54.23,57.02 55.12,57.02 58.17,60.07 C2.1 60.71,59.06 60.71,57.78 v60.45,57.53 | L1.1 63.5,61.59 62.61,60.71 62.61,57.53 | 62.61,57.53 62.61,52.2 63.88,50.93 63.88,45.47 61.98,43.56 60.96,43.56 | 60.96,43.56 59.94,43.56 57.28,46.23 56.64,46.23 | 62.61,57.53 v62.74,57.53 | 45.02,41.97 46.48,40.51 60.07,40.51 60.96,41.4 60.96,43.56 | v28.96,44.83 28.57,45.21 28.57,46.1 28.51,46.16 | v33.91,44.83 35.43,44.83 D2.C | 16.51,46.99 IC1.4 | IC1.2 21.39,46.99 | 14.73,54.48 14.61,54.61
  Top 0.508: 46.42,43.37 45.02,41.97 44.96,41.91 C1.1 36.7,37.08 | 21.39,46.99 20.13,45.72 19.24,45.72 17.98,46.99 IC1.4 12.7,46.99 12.7,52.96 13.08,53.34 13.97,53.34 14.73,54.1 14.73,54.48 | 14.61,54.61 13.46,54.61
  Bottom 0.254: v23.24,69.85 23.24,65.02 v23.88,64.39 25.53,64.39 v26.16,63.75 | v62.74,57.53 v60.45,57.53 | v33.91,44.83 v28.96,44.83
AGND  (via drill 0.5)  (1 unrouted)
  Top 0.254: 62.1,38.86 R2.1 61.6,38.86 61.6,40.64 v61.72,40.64 | v54.1,42.04 54.1,43.69 | v59.31,38.73 58.93,38.73 58.42,38.23 56.77,38.23 v55.5,39.5 53.21,37.21 C6.1
  Bottom 0.254: v54.1,42.04 54.1,40.89 v55.5,39.5 | v59.31,38.73 59.56,38.99 60.07,38.99 v61.72,40.64
AREF  (via drill 0.5)  (1 unrouted)
  Top 0.254: 53.21,44.32 53.21,43.81 53.21,42.42 52.83,42.04 50.93,42.04 v50.8,41.91 | C6.2 50.8,37.59 v50.8,39.37
  Bottom 0.254: v50.8,39.37 50.93,39.5 50.93,41.78 v50.8,41.91
AVCC  (via drill 0.5)  (3 unrouted)
  Top 0.254: C5.1 65.41,61.85 63.5,59.94 L1.2 v63.5,58.55 | v60.48,52.07 60.48,53.34 59.53,54.29 59.53,57.94 59.69,58.1 59.69,58.42 v59.82,58.55 | v58.9,43.34 58.26,43.34 57.15,44.45 | 56.99,44.61 57.15,44.45 | 54.77,44.61 54.8,44.61 | 57.15,44.45 | 57.15,44.45 57.06,44.45 56.99,44.52 55.95,44.52 54.61,43.18
  Bottom 0.254: v59.82,58.55 v63.5,58.55 | v60.48,52.07 62.71,49.85 62.71,48.1 62.23,48.1 60.48,46.36 60.48,43.34 v58.9,43.34
CMP  (via drill 0.5)
  Top 0.254: RN1.7 36.2,50.04 36.2,50.67 RN1.8 36.32,50.8 37.21,51.69 v37.34,51.69 | v37.47,60.83 26.42,71.88 IC2.5 | C22.2 28.32,74.17 v31.62,70.87
  Bottom 0.254: v37.34,51.69 37.34,52.07 37.47,52.2 v37.47,60.83 31.62,66.67 v31.62,70.87
D+  (via drill 0.5)
  Top 0.254: Z1.1 15.62,68.58 15.75,68.71 15.75,71.12 RN3.8 15.62,71.12 9.65,71.12 v7.37,73.41 6.35,73.41 6.1,73.66 J1.P3
  Bottom 0.254: v7.37,73.41 D+.X
D-  (via drill 0.5)
  Top 0.254: Z2.1 15.62,76.2 15.75,76.07 v15.75,74.93 15.75,73.66 RN3.5 15.62,73.66 15.49,73.66 14.99,73.15 12.7,73.15 11.56,74.3 5.33,74.3 J1.P2
  Bottom 0.254: v15.75,74.93 D-.X
GATE_CMD
  Top 0.254: T1.3 23.88,61.72 22.99,62.61 22.99,68.33 25.02,70.36 25.02,71.88 IC2.7
GND  (via drill 0.5)  (7 unrouted)
  Top 0.254: 61.21,77.47 LED2.C | 61.21,77.47 60.58,78.11 IC3.4 59.94,78.11 57.15,80.9 57.15,87.63 57.66,88.14 58.29,88.14 U$10.7 | 61.21,77.47 60.58,76.83 IC3.3 60.45,76.83 60.45,75.56 | 60.45,75.56 IC3.7 | 60.45,75.56 60.45,74.3 IC3.1 60.58,74.3 68.33,66.55 68.33,61.47 67.31,60.45 C5.2 67.31,41.66 63.56,37.91 60.67,37.91 | 60.45,75.56 IC3.2 | 16.76,83.82 16.76,87.5 14.48,89.79 RESET.3 14.35,89.92 5.97,89.92 RESET.4 | 16.76,83.82 16.76,78.49 17.4,77.85 17.4,76.2 Z2.2 17.53,76.2 v17.53,74.55 | 68.58,85.09 69.21,85.09 69.6,85.47 69.6,87.25 69.21,87.63 68.58,87.63 X3.2 | 57.47,93.15 57.53,93.22 58.42,93.22 U$10.10 | 57.47,93.15 57.15,92.84 57.15,90.55 58.42,89.28 58.42,88.14 U$10.7 | 57.21,95.06 57.15,95 57.15,93.47 57.47,93.15 | 57.21,95.06 57.53,95.38 58.42,95.38 U$10.12 | 68.58,85.09 62.23,85.09 59.31,88.01 58.55,88.01 U$10.7 | 68.58,85.09 X3.1 | 37.4,86.3 37.47,86.36 C17.2 | 37.4,86.3 34.93,83.82 R15.1 | R15.1 35.05,83.82 37.59,81.28 C18.2 38.61,81.28 39.62,82.3 41.66,82.3 42.42,81.53 46.36,81.53 U$10.24 | 38.29,95.06 37.08,93.85 37.08,86.61 37.4,86.3 | 38.29,95.06 38.48,95.25 C19.2 38.61,95.25 39.62,96.27 45.59,96.27 46.36,95.5 U$10.13 46.48,95.38 47.37,95.38 47.62,95.12 57.15,95.12 57.21,95.06 | R15.1 16.76,83.82 | C4.2 51.69,67.31 52.96,66.04 Y1.4 53.09,65.91 53.47,65.91 58.36,61.02 | 58.36,61.02 59.18,61.85 C2.2 | 58.36,61.02 57.4,60.07 C3.1 v53.59,57.78 52.45,56.64 52.45,55.37 | v59.56,45.34 60.2,44.7 60.2,44.45 R3.1 | v61.72,49.53 61.72,50.67 C9.1 | v51.18,61.98 51.18,63.5 Y1.2 | 47.62,43.69 47.62,43.05 49.66,41.02 55.25,41.02 v56.64,42.42 | 45.72,20.32 U4.87 U4.88 U4.83
  Top 0.254: U4.58 53.09,14.86 53.09,17.02 53.34,17.27 U4.82 53.21,17.27 50.93,17.27 U4.81 50.8,17.4 48.26,17.4 U4.80 48.13,17.4 45.72,17.4 U4.79 45.72,17.53 45.72,20.32 | 45.72,20.32 U4.78 45.59,20.32 45.59,23.11 U4.77 | 41.15,18.8 41.4,18.8 U4.6 | 41.4,16.13 U4.8 41.28,16.19 40.8,16.67 40.64,16.67 40.48,16.83 40.48,18.26 40.56,18.34 | U4.44 43.18,23.24 U4.45 43.31,23.24 45.59,23.24 U4.77 | U4.44 43.05,24.51 41.53,24.51 U4.2 41.4,24.64 | U4.43 43.18,25.91 43.18,24.64 U4.44 | U4.76 44.58,25.91 43.31,25.91 U4.43 | U4.41 43.18,27.3 43.18,26.04 U4.43 | 41.02,19.18 41.02,18.8 U4.6 | U4.77 45.72,23.37 48.13,23.37 U4.86 48.26,23.37 50.8,23.37 U4.85 | U4.67 54.61,24.51 53.47,23.37 U4.84 53.34,23.37 51.69,23.37 | 51.69,23.37 50.93,23.37 U4.85 | U4.71 51.56,25.91 50.29,25.91 U4.72 50.17,25.91 48.9,25.91 U4.73 48.9,26.04 48.9,27.3 U4.37 | U4.35 51.56,27.3 51.56,26.04 U4.71 | 60.2,38.86 60.2,38.48 60.15,38.43 60.67,37.91 | 60.2,38.86 60.2,39.37 59.94,39.62 v56.77,39.62 | U4.37 48.77,27.43 48.64,27.56 48.64,32.51 49.02,32.89 49.78,32.89 51.44,34.54 56.26,34.54 59.63,37.91 60.67,37.91 | U4.37 48.64,27.43 47.5,27.43 U4.38 47.37,27.43 46.1,27.43 U4.39 46.1,27.56 39.62,34.04 34.29,34.04 C12.- 34.29,34.16 32.7,35.75 | 51.69,23.37 51.69,25.78 U4.71 | 51.69,23.37 U4.85 | 60.2,38.86 R2.2 | v39.37,4.45 D5.2 | C15.2 43.43,3.05 38.35,3.05 36.89,4.51 v36.83,4.45 20.8,4.45 X1.GND@1 | 21.97,12.7 21.97,11.43 21.84,11.43 20.95,10.54 X2.GND@4 20.83,10.41 20.83,3.81 X1.GND@1 | 21.97,12.7 21.97,15.37 21.34,16 20.7,16 X2.GND | 5.33,10.16 8.38,10.16 X1.GND@2 16.51,2.03 18.8,2.03 20.07,3.3 X1.GND@1 | 5.33,10.16 X2.GND@3
  Top 0.254: 38.61,75.56 38.61,73.15 BT2.2 | 38.61,75.56 38.61,78.74 C16.2 | 38.61,75.56 34.04,75.56 33.53,75.06 30.1,75.06 C22.1 29.08,75.95 27.94,75.95 26.92,74.93 R4.1 24.13,74.04 v24.13,73.91 | 17.53,66.04 17.53,68.58 Z1.2 17.4,68.58 16.64,69.34 v16.64,69.72 | v26.42,66.42 26.42,67.69 IC2.4 | 15.11,63.25 15.11,63.63 17.53,66.04 | 15.11,63.25 15.11,62.23 C8.- 15.11,63.25 | 17.53,66.04 L2.2 | RN1.3 34.93,49.15 34.93,49.91 RN1.2 34.8,50.04 34.16,50.04 | 32.51,50.04 30.86,50.04 C11.1 30.1,51.18 28.83,52.45 C13.2 | 32.51,50.04 34.16,50.04 | 44.96,53.47 35.81,53.47 34.16,51.82 34.16,50.04 | 4.06,52.07 L.C | C14.1 28.32,44.2 26.99,45.53 | 26.99,45.53 26.92,45.59 26.92,46.48 27.43,46.99 U3.2 | 26.99,45.53 26.16,44.7 22.22,44.7 IC1.1 | 22.1,44.7 IC1.1 | C1.2 38.23,41.91 34.67,38.35 33.02,38.35 32.96,38.29 | 32.96,38.29 32.64,37.97 32.64,35.81 32.7,35.75 | 29.21,33.4 30.35,33.4 32.7,35.75 | 20.95,26.04 20.95,30.86 24.13,34.04 C10.- | 20.95,26.04 20.95,25.78 X2.GND@1 | 20.95,26.04 5.33,26.04 | 5.33,26.04 X2.GND@2 5.33,25.91 5.33,10.16 | 20.95,26.04 X2.GND@1 | 29.21,33.4 24.64,33.4 24.13,33.91 C10.- | 29.21,33.4 D1.A | IC1.1 22.22,44.58 22.22,36.07 24.13,34.16 C10.- | 32.51,50.04 32.51,38.73 32.96,38.29 | 3.94,52.07 L.C | J1.S5 J1.S6 | 22.1,12.7 21.97,12.7 | 5.33,26.04 9.7,30.4 EXTPOWER.1 9.7,35.03 EXTPOWER.3 4.03,40.7 ON.C 4.32,46.99 4.03,47.28 L.C | X2.GND@1 24.13,28.95 v24.13,29.21 | v25.4,24.13 29.21,24.13 | U6.2 39.37,93.98 38.29,95.06 | 40.56,18.34 40.96,18.73 U4.6 | 29.21,24.13 34.93,18.41 40.48,18.41 40.56,18.34 | 29.21,24.13 SJ1.1 | J1.S1 4.42,76.96 J1.S3 | J1.S2 4.42,70.36 J1.S4
  Bottom 0.254: v51.18,61.98 51.18,60.07 53.53,57.72 | 53.53,57.72 v61.72,49.53 59.56,47.37 v59.56,45.34 v56.64,42.42 56.77,42.42 v56.77,39.62 | v53.59,57.78 53.53,57.72 | v39.37,4.45 v36.83,4.45 21.46,4.45 X1.GND@1 X1.GND@2 | GND.X 10.16,72.39 12.83,69.72 v16.64,69.72 17.59,70.68 | v26.42,66.42 26.42,67.94 23.69,70.68 | 23.69,70.68 23.62,70.74 17.65,70.74 17.59,70.68 | v24.13,73.91 24.13,71.12 23.69,70.68 | v17.53,74.55 17.53,70.74 17.59,70.68 | v24.13,29.21 25.4,27.94 v25.4,24.13
  pour Top: 0,97.79 0,0 76.2,0 76.2,97.79
GPS_RXD  (via drill 0.5)  (1 unrouted)
  Top 0.254: v47.62,70.23 47.62,55.37 | v48.13,83.95 47.37,84.71 46.48,84.71 U$10.21
  Bottom 0.254: v47.62,70.23 47.62,83.44 v48.13,83.95
GPS_TXD  (via drill 0.5)  (1 unrouted)
  Top 0.254: v48.51,69.47 48.51,55.37 | v48.51,82.8 48.51,83.06 49.02,83.57 49.02,84.33 47.5,85.85 46.48,85.85 U$10.20
  Bottom 0.254: v48.51,82.8 v48.51,69.47
GSCL
  Top 0.254: IC3.6 53.09,76.83 52.32,77.6 52.32,81.92 47.24,87 46.48,87 U$10.19
GSDA
  Top 0.254: U$10.18 46.48,88.01 47.37,88.01 53.72,81.66 53.72,78.11 IC3.5
GSM_ANT
  Top 0.254: X1.P 17.78,21.46 19.56,23.24 20.19,23.24 26.54,29.59 42.67,29.59 44.58,27.69 44.58,27.43 U4.40
GSM_RXD  (via drill 0.5)
  Top 0.254: v49.53,39.5 D9.C | v50.42,58.04 50.42,56.9 50,56.48 U2.18
  Bottom 0.254: v49.53,39.5 42.66,46.36 42.66,52.89 43.18,53.41 43.18,57.15 44.07,58.04 v50.42,58.04
GSM_TXD  (via drill 0.5)  (1 unrouted)
  Top 0.254: v55.88,33.15 55.88,27.43 U4.32 | v49.91,64.26 49.28,63.63 49.28,55.37
  Bottom 0.254: v55.88,33.15 55.88,36.07 63.37,43.56 63.37,50.42 58.67,55.12 58.17,55.12 54.99,58.29 54.99,60.2 50.93,64.26 v49.91,64.26
HWB
  Top 0.254: RN1.6 37.23,49.13 40.83,45.53 U2.33
IO13*  (via drill 0.5)  (1 unrouted)
  Top 0.254: v27.81,67.69 26.67,68.83 26.16,68.83 25.78,68.45 25.78,67.82 IC2.3 | v36.58,52.58 38.1,52.58 44.32,46.36 44.96,46.36
  Bottom 0.254: v27.81,67.69 27.81,61.34 v36.58,52.58
KEY
  Top 0.254: SJ1.2 33.78,21.59 D7.C
LL
  Top 0.254: RN2.2 13.46,55.5 20.32,55.5 25.27,60.45 25.27,66.8 25.15,66.93 25.15,67.69 IC2.2 25.02,67.82 24.51,67.82 IC2.1
N$1
  Top 0.254: R5.2 61.72,81.28 59.31,83.69 58.55,83.69 U$10.3
N$2
  Top 0.254: R5.1 66.8,81.28 66.8,78.36 67.69,77.47 LED2.A
N$3
  Top 0.254: R6.2 58.8,91.44 58.55,91.19 U$10.8 58.55,91.31 58.55,92.08 U$10.9
N$4
  Top 0.254: X3.3 67.06,88.65 68.71,90.3 68.71,92.84 67.31,94.23 L3.2 58.55,94.36 U$10.11
N$5
  Top 0.254: R15.2 LED1.C
N$6  (via drill 0.35)
  other vias: 66.04,87.63
N$7
  Top 0.127: U4.48 42.53,19.56 40.13,19.56 38.1,21.59
  Top 0.254: D7.A 38.1,21.59
N$8
  Top 0.254: RN2.8 10.36,54.68 6.22,50.55 6.22,46.99 ON.A
N$9
  Top 0.254: D6.C 43.69,74.17 43.69,77.47 R7.2
N$10
  Top 0.254: R6.1 67.06,91.44 67.31,91.19 L3.1
N$11
  Top 0.254: RN2.7 11.94,55.37 9.53,55.37 6.22,52.07 L.A
N$12  (via drill 0.5)
  Top 0.254: R7.1 45.09,77.47 v45.09,76.2 45.09,73.79 41.78,70.48 37.72,70.48 34.8,73.41 34.8,74.42 BT2.1 | v44.83,83.82 46.36,83.82 U$10.22
  Bottom 0.254: v44.83,83.82 44.83,76.45 v45.09,76.2
N$13  (via drill 0.35)
  other vias: 66.04,88.9
N$14
  Top 0.254: RN2.6 11.94,56.39 6.98,56.39 6.22,57.15 TX.A
N$15
  Top 0.254: RN2.5 11.94,57.15 11.3,57.15 6.22,62.23 RX.A
N$16  (via drill 0.35)
  other vias: 64.77,95.25
N$17  (via drill 0.35)
  other vias: 63.5,95.25
N$18  (via drill 0.35)
  other vias: 62.23,95.25
N$19  (via drill 0.35)
  other vias: 60.96,95.25
N$20  (via drill 0.35)
  other vias: 60.96,93.47
N$21  (via drill 0.35)
  other vias: 62.36,93.47
N$22  (via drill 0.35)
  other vias: 63.63,93.47
N$23  (via drill 0.35)
  other vias: 64.77,93.47
N$24  (via drill 0.35)
  other vias: 66.93,89.79
N$25  (via drill 0.35)
  other vias: 69.09,89.41
N$26  (via drill 0.35)
  other vias: 69.72,90.3
N$27  (via drill 0.35)
  other vias: 19.05,46.99
N$28  (via drill 0.35)
  other vias: 69.85,91.44
N$29  (via drill 0.35)
  other vias: 69.6,92.58
N$30  (via drill 0.35)
  other vias: 69.09,93.73
RD+  (1 unrouted)
  Top 0.254: 56.64,47.88 57.28,47.88 57.91,47.24 60.45,47.24 60.96,47.75 60.96,48.64 60.83,48.77 60.83,49.91 60.96,50.04 60.96,51.31 61.34,51.69 61.34,61.59 51.82,71.12 47.24,71.12 46.1,69.98 31.24,69.98 28.19,73.03 22.61,73.03 20.83,71.25 17.27,71.25 RN3.1
RD-  (1 unrouted)
  Top 0.254: 56.64,47.12 57.28,47.12 58.17,46.23 62.87,46.23 63.37,46.74 63.37,50.67 61.85,52.2 61.85,61.85 52.32,71.37 52.32,73.91 51.31,74.93 51.05,74.93 46.23,79.76 25.15,79.76 19.05,73.66 17.27,73.66 RN3.4
RESET  (via drill 0.5)  (1 unrouted)
  Top 0.254: RESET.2 5.97,85.47 14.35,85.47 RESET.1 14.48,85.34 v15.88,85.34 | RN1.4 34.8,48.26 v34.8,47.37 34.8,46.99 33.02,45.21 33.02,44.07 35.56,41.53 D2.A | v57.02,57.66 56.52,57.66 55.37,56.52 54.61,56.52 54.1,56.01 54.1,55.37 | v46.67,64.45 v42.39,60.17
  Bottom 0.254: v34.8,47.37 42.29,54.86 42.39,54.93 v42.39,60.17 | v15.88,85.34 29.72,85.34 48.64,66.42 | 48.64,66.42 49.91,65.15 50.8,65.15 57.02,58.93 v57.02,57.66 | 48.64,66.42 v46.67,64.45
RXLED  (via drill 0.5)  (1 unrouted)
  Top 0.254: v4.95,60.96 4.06,61.85 4.06,62.23 RX.C | v58.55,56.01 58.55,52.45 57.28,51.18 56.64,51.18
  Bottom 0.254: v4.95,60.96 4.95,68.45 8,71.5 8,72.77 14.99,79.76 14.99,85.73 15.49,86.23 32.38,86.23 46.74,71.88 46.74,69.85 50.93,65.66 51.05,65.66 58.55,58.17 v58.55,56.01
SIMCLK  (via drill 0.5)
  Top 0.127: v41.02,7.87 44.58,11.43 47.18,11.43 48.13,12.38 48.13,14.02 48.83,14.72
  Top 0.254: v41.02,7.87 40.51,7.37 40.13,7.37 D5.4 | v26.54,22.35 20.7,22.35 X2.CLK | U4.55 48.83,14.72
  Bottom 0.254: v26.54,22.35 30.52,18.37 31.79,19.64 41.02,10.41 v41.02,7.87
SIMDATA
  Top 0.254: D5.5 39.37,7.62 39.43,7.68 | 39.43,7.68 43.94,12.19 46.61,12.19 47.37,12.95 47.37,13.21 U4.14 | 39.43,7.68 26.04,21.08 20.7,21.08 X2.I/O
SIMRST
  Top 0.254: U4.15 48.77,13.21 48.77,12.95 48.64,12.82 48.64,12.17 47.39,10.92 46.61,10.92 41.15,5.46 40.13,5.46 D5.3 40.13,5.59 40.13,5.71 39.75,6.1 38.74,6.1 25.02,19.81 20.7,19.81 X2.RST
TXLED  (via drill 0.5)  (1 unrouted)
  Top 0.254: v6.98,60.07 4.06,57.15 TX.C | 46.74,55.37 v31.62,55.37
  Bottom 0.254: v6.98,60.07 9.02,60.07 14.61,65.66 21.34,65.66 v31.62,55.37
UART_RXD
  Top 0.254: D9.A 51.82,34.04 56.26,34.04 57.15,33.15 57.15,27.43 U4.31
UCAP  (1 unrouted)
  Top 0.254: C7.1 58.55,48.26 57.28,49.53
UGND  (via drill 0.5)  (1 unrouted)
  Top 0.254: v62.36,45.34 61.72,44.7 61.72,44.45 R3.2 | v62.48,47.12 62.48,47.62 C7.2 | v14.99,64.77 15.37,65.15 15.37,66.04 L2.1 13.33,66.04 7.04,72.34 J1.P5 | v58.8,41.53 v56.64,43.69
  Bottom 0.254: v62.48,47.12 62.36,46.99 v62.36,45.34 62.36,44.07 59.31,41.02 | v14.99,64.77 14.99,59.94 29.21,45.72 42.29,45.72 49.4,38.61 57.4,38.61 59.56,40.77 59.31,41.02 | 59.31,41.02 v58.8,41.53
VCC  (via drill 0.5)
  Top 0.254: C16.1 45.72,78.74 D6.A | 40.13,83.82 40.13,86.36 C17.1 40.32,86.44 | C18.1 41.91,81.28 42.55,80.64 47.5,80.64 47.56,80.71 | 47.56,80.71 47.75,80.9 47.75,82.17 47.37,82.55 46.48,82.55 U$10.23 46.36,82.68 44.7,82.68 43.56,83.82 40.13,83.82 | 40.13,83.82 LED1.A | IC3.8 53.09,74.3 51.5,75.88 | 51.5,75.88 47.62,79.76 47.62,80.64 47.56,80.71 | v51.44,75.82 51.5,75.88
  Top 0.406: U6.5 40.32,86.44
  Bottom 0.254: D6.A 50.8,75.18 v51.44,75.82
VCC_IN
  Top 0.254: U6.1 40.32,95.17 C19.1 | 38.42,92.39 U6.3 38.42,91.76 38.61,91.57 40.39,91.57 40.39,92.62 U6.1 | 40.32,92.39 U6.1
VIN  (via drill 0.5)
  Top 0.254: C10.+ 24.13,37.08 28.57,37.08 29.21,37.72 D1.C 29.21,38.23 31.5,40.51 v31.5,49.15 | v35.31,51.69 34.93,51.31 34.93,50.8 RN1.1 | 22.22,49.4 IC1.3
  Top 0.508: 22.22,49.4 v24.51,51.69 | C10.+ v24.13,41.91
  Bottom 0.508: v24.51,51.69 31.5,51.69 | 31.5,51.69 v35.31,51.69 | 31.5,51.69 v31.5,49.15 | EXTPOWER.2 16.59,41.91 v24.13,41.91
VRTC
  Top 0.127: C15.1 50.8,11.18 50.8,12.19 50.93,12.32 50.93,13.97 | 50.93,14.1 50.93,13.97 | 50.93,13.97 50.23,14.67 U4.56
VUSB  (via drill 0.5)  (1 unrouted)
  Top 0.254: C8.+ 21.84,62.23 | 59.44,50.8 57.66,50.8 57.28,50.42 56.64,50.42 | 59.44,50.8 C9.2 | R4.2 23.24,75.82 v22.86,76.2 | v20.19,78.87 19.68,78.87 18.54,80.01 F1.1 | v59.44,53.09 59.44,50.8 | 21.84,62.23 21.84,70.99 v22.73,71.88 | 21.84,62.23 T1.1
  Bottom 0.254: v20.19,78.87 v22.86,76.2 | v59.44,53.09 54.48,58.04 54.48,59.94 51.05,63.37 40.39,63.37 27.56,76.2 v22.86,76.2 | v22.73,71.88 22.73,76.2 v22.86,76.2
XTAL1  (1 unrouted)
  Top 0.254: C4.1 49.91,67.18 51.05,66.04 Y1.1 51.18,65.91 52.07,65.02 52.07,61.59 51.18,60.71 R1.1 51.31,59.56 51.31,57.49 51.09,57.27 51.09,56.3 50.8,56.01
XTAL2
  Top 0.254: 52.96,61.85 52.96,63.5 Y1.3 | 52.96,61.85 R1.2 52.96,59.31 52.07,58.42 51.88,58.23 51.88,57.34 51.88,57.15 51.88,56.17 51.79,56.08 51.79,55.52 U2.16 | 52.96,61.85 C3.2
XUSB  (via drill 0.5)
  Top 0.254: F1.2 14.48,80.01 12.32,77.85 v9.27,77.85 9.27,76.58 7.67,74.98 J1.P1
  Bottom 0.254: VUSB.X 8,77.85 v9.27,77.85

### Text on the board
tPlace: FORTIS FORTUNA ADIUVAT